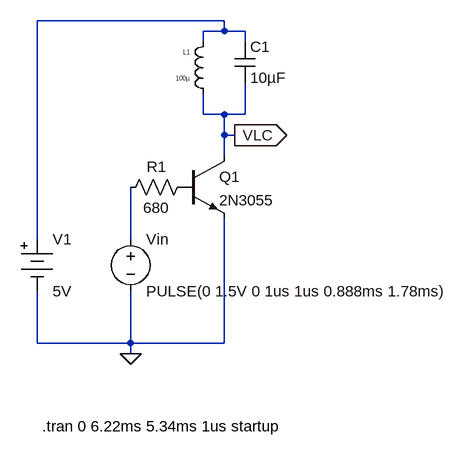
[diagram p0: schematic Lesson22_Parallel_AC.asc]
Lesson22_Parallel_AC.asc, the LTspice schematic file:
Version 4
SHEET 1 880 1072
WIRE 112 432 -176 432
WIRE 112 448 112 432
WIRE 112 448 80 448
WIRE 144 448 112 448
WIRE 80 464 80 448
WIRE 144 464 144 448
WIRE 80 576 80 544
WIRE 112 576 80 576
WIRE 144 576 144 528
WIRE 144 576 112 576
WIRE 112 608 112 576
WIRE 128 608 112 608
WIRE 112 640 112 608
WIRE -176 768 -176 432
WIRE -32 768 -32 688
WIRE -176 928 -176 848
WIRE -32 928 -32 848
WIRE -32 928 -176 928
WIRE 112 928 112 736
WIRE 112 928 -32 928
WIRE -32 944 -32 928
FLAG -32 944 0
FLAG 128 608 VLC
IOPIN 128 608 Out
SYMBOL ind 96 560 R180
WINDOW 0 36 80 Left 0
WINDOW 3 36 40 Left 0
SYMATTR InstName L1
SYMATTR Value 100µ
SYMATTR SpiceLine Ipk=1 Rser=85m Rpar=infin. Cpar=0 mfg="Coiltronics" pn="CTX100-1-52"
SYMBOL cap 128 464 R0
SYMATTR InstName C1
SYMATTR Value 10µF
SYMBOL Misc/battery -176 752 R0
SYMATTR InstName V1
SYMATTR Value 5V
SYMATTR SpiceLine Rser=3
SYMBOL npn 48 640 R0
SYMATTR InstName Q1
SYMATTR Value 2N3055
SYMBOL res 64 672 R90
WINDOW 0 0 56 VBottom 2
WINDOW 3 32 56 VTop 2
SYMATTR InstName R1
SYMATTR Value 680
SYMBOL voltage -32 752 R0
SYMATTR InstName Vin
SYMATTR Value PULSE(0 1.5V 0 1us 1us 0.888ms 1.78ms)
SYMATTR SpiceLine Rser=0
TEXT -168 1056 Left 2 !.tran 0 6.22ms 5.34ms 1us startup

The netlist it stands for:
* Lesson22_Parallel_AC.asc
L1 VLC N001 100µ Ipk=1 Rser=85m Rpar=infin. Cpar=0 mfg="Coiltronics" pn="CTX100-1-52"
C1 N001 VLC 10µF
V1 N001 0 5V Rser=3
Q1 VLC P001 0 0 2N3055
R1 P001 N002 680
Vin N002 0 PULSE(0 1.5V 0 1us 1us 0.888ms 1.78ms) Rser=0
.model NPN NPN
.model PNP PNP
.lib standard.bjt
.tran 0 6.22ms 5.34ms 1us startup
.backanno
.end